# EAGLE design Micro-SD (EAGLE 5.06)
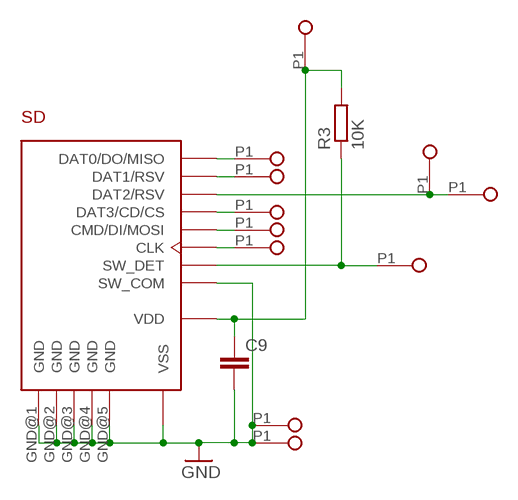
[diagram p0: schematic, sheet 1]

## Parts
C9  C-EUC0805  [C0805]
R3  10K  R-EU_M0805  [M0805]
SD  SDSLOT_MICRO  [MOLEX-49225-0821]
U$1  PAD  [PAD1]
U$2  PAD  [PAD1]
U$3  PAD  [PAD1]
U$17  PAD  [PAD1]
U$18  PAD  [PAD1]
U$19  PAD  [PAD1]
U$20  PAD  [PAD1]
U$21  PAD  [PAD1]
U$22  PAD  [PAD1]
U$23  PAD  [PAD1]
U$24  PAD  [PAD1]

## Nets
CLK: SD.4(CLK) U$22.P1
CMD: SD.6(CMD/DI/MOSI) U$21.P1
DAT0: SD.2(DAT0/DO/MISO) U$17.P1
DAT1: SD.1(DAT1/RSV) U$18.P1
DAT2: SD.8(DAT2/RSV) U$3.P1 U$19.P1
DAT3: SD.7(DAT3/CD/CS) U$20.P1
GND: C9.2 SD.3(VSS) SD.CD1(SW_COM) SD.GND@1(GND) SD.GND@2(GND) SD.GND@3(GND) SD.GND@4(GND) SD.GND@5(GND) U$1.P1 U$2.P1
SDVCC: C9.1 R3.2 SD.5(VDD) U$23.P1
SWDET: R3.1 SD.CD2(SW_DET) U$24.P1

## Library data of the parts
C9 = turbod3:C-EU: CAPACITOR, European symbol
R3 = turbod3:R-EU_: RESISTOR, European symbol
SD = turbod3:SDSLOT_MICRO
U$1-U$3 U$17-U$24 = turbod3:PAD

## Board
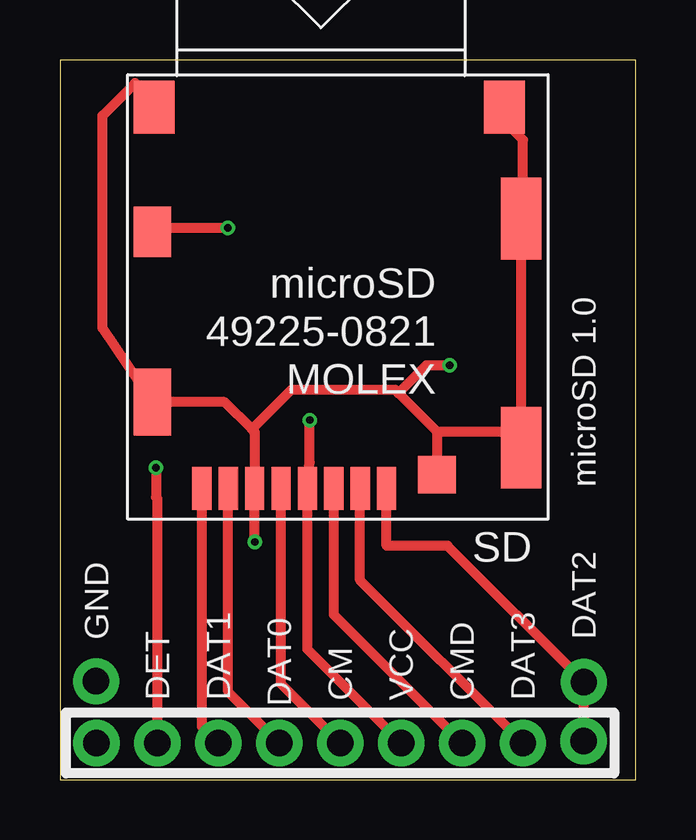
[diagram p1: board, top side]
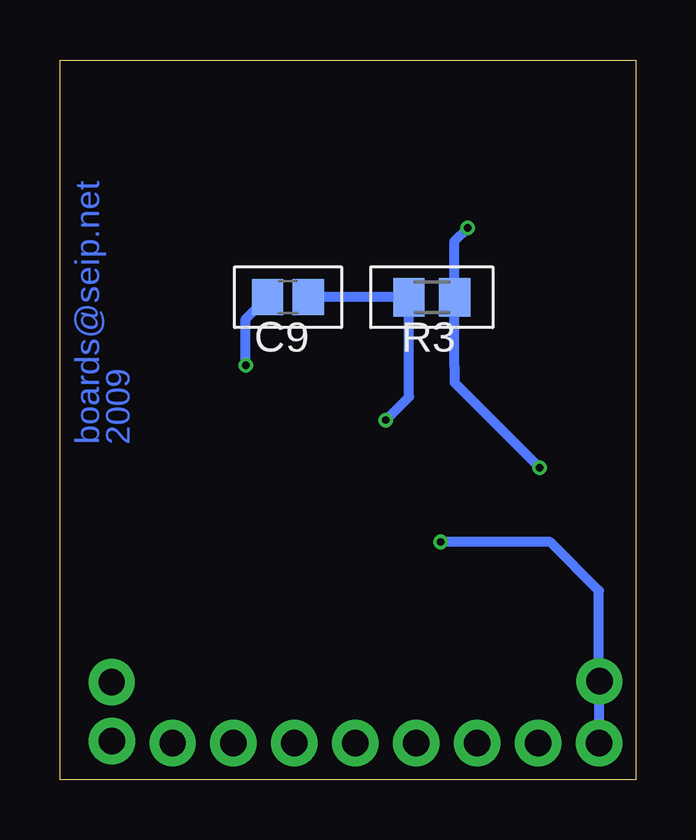
[diagram p2: board, bottom side, seen from below]

Size 24 x 30 mm. Coordinates in mm from the lower left corner, seen from the top.
Outline: 0,0 24,0 24,30 0,30 0,0
Copper layers (1*16): Top 0.035mm / dielectric 1.5mm / Bottom 0.035mm
Design rules "PCB-POOL": minimum track width 6mil, minimum drill 12mil, track to track 6mil, track to pad 6mil, pad to pad 6mil, via to via 6mil, smd to smd 6mil, copper to edge 20mil, drill to drill 8mil, minimum pad ring 8mil, minimum via ring 6mil, stop-mask expansion 3mil, vias tented up to drill 0mil, thermal gap 8mil

### Footprints (pad centres in the part's own frame; a part is rotated, then mirrored left to right if it is on the bottom)
C0805 = smd 1.3 x 1.5: 1 -0.85,0; 2 0.85,0
M0805 = smd 1.3 x 1.6: 1 -0.95,0; 2 0.95,0
MOLEX-49225-0821 = smd 0.8 x 1.8: 1 -2.24,17.2; 2 -3.34,17.2; 3 -4.44,17.2; 4 -5.54,17.2; 5 -6.64,17.2; 6 -7.74,17.2; 7 -8.84,17.2; 8 -9.94,17.2 | smd 1.55 x 2.8: CD1 -0.175,13.6 | smd 1.55 x 2.1: CD2 -0.175,6.5 | smd 1.7 x 3.4: GND@1 -15.55,15.5; GND@2 -15.55,5.95 | smd 1.7 x 2.2: GND@3 -0.25,1.3; GND@4 -14.85,1.3 | smd 1.6 x 1.55: GND@5 -12.04,16.625
PAD1 = drill 1.1 pad 1.93 round: P1 0,0

### Placement (x,y rotation side)
C9  14.49,20.11 180 bottom
R3  8.49,20.11 180 bottom
SD  3.68,29.34 180 top
U$1  1.52,1.52 0 top
U$2  1.51,4.1 0 top
U$3  21.83,1.6 0 top
U$17  9.14,1.52 0 top
U$18  6.6,1.52 0 top
U$19  21.84,4.06 0 top
U$20  19.3,1.52 0 top
U$21  16.76,1.52 0 top
U$22  11.68,1.52 0 top
U$23  14.22,1.52 0 top
U$24  4.06,1.52 0 top

### Tracks (layer width: path | path; a pad name or v marks a point on that pad's centre or on a via)
CLK
  Top 0.406: SD.4 9.22,3.99 U$22.P1
CMD
  Top 0.406: SD.6 11.42,6.87 U$21.P1
DAT0
  Top 0.406: SD.2 7.02,3.65 U$17.P1
DAT1
  Top 0.406: SD.1 5.92,2.21 U$18.P1
DAT2
  Top 0.406: SD.8 13.62,9.75 16.16,9.75 U$19.P1 21.84,1.62 U$3.P1
DAT3
  Top 0.406: SD.7 12.52,8.31 U$20.P1
GND  (via drill 0.3)
  Top 0.406: v8.13,9.91 v8.12,9.91 SD.3 8.13,13.14 8.13,14.48 8,14.61 | SD.GND@3 3.13,29.04 1.78,27.69 1.78,18.81 SD.CD1 6.87,15.74 8,14.61 | SD.GND@4 18.53,27.44 19.3,26.67 19.3,24.46 SD.GND@2 SD.GND@1 18.56,14.51 15.72,14.51 | 15.72,14.51 SD.GND@5 | 14.11,16.11 13.97,16.26 9.65,16.26 8,14.61 | 14.11,16.11 15.72,14.51 | v16.26,17.27 15.27,17.27 14.11,16.11
  Bottom 0.406: v8.13,9.91 3.56,9.91 1.52,7.87 1.52,4.11 U$2.P1 1.51,1.54 U$1.P1 | v16.26,17.27 16.26,19.2 C9.2
SDVCC  (via drill 0.3)
  Top 0.406: U$23.P1 10.32,5.43 SD.5 10.41,13.23 v10.41,14.99
  Bottom 0.406: C9.1 R3.2 9.44,15.96 v10.41,14.99
SWDET  (via drill 0.3)
  Top 0.406: U$24.P1 4.06,11.72 4,11.78 v4,13 | v7,23 4.02,23 SD.CD2
  Bottom 0.406: v7,23 7.54,22.46 R3.1 7.54,17.19 7.54,16.54 v4,13

### Text on the board
Bottom: 2009 | boards@seip.net
tNames: microSD 1.0 | GND | DAT2 | DET | DAT1 | DAT0 | CM | VCC | CMD | DAT3